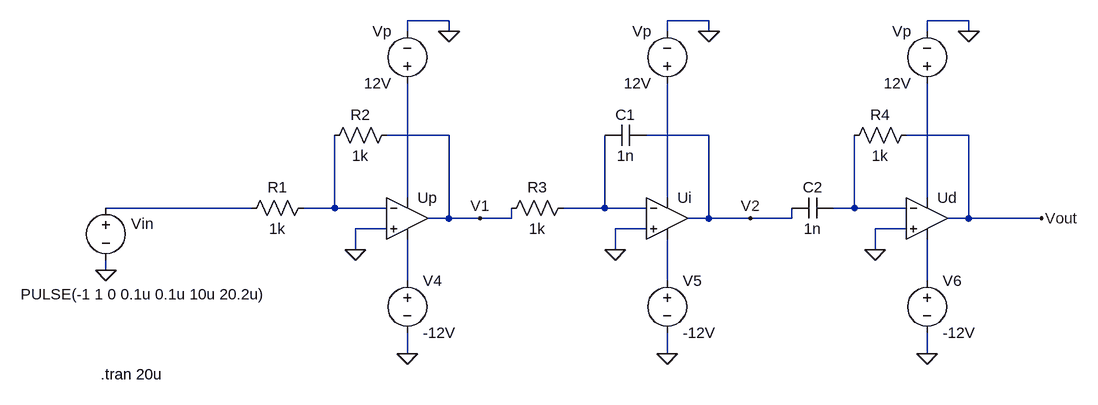
[diagram p0: schematic Draft1.asc]
Draft1.asc, the LTspice schematic file:
Version 4
SHEET 1 984 680
WIRE 0 -144 -64 -144
WIRE 400 -144 336 -144
WIRE 800 -144 736 -144
WIRE -64 -128 -64 -144
WIRE 0 -128 0 -144
WIRE 336 -128 336 -144
WIRE 400 -128 400 -144
WIRE 736 -128 736 -144
WIRE 800 -128 800 -144
WIRE 0 32 -96 32
WIRE 400 32 304 32
WIRE 800 32 704 32
WIRE -64 128 -64 -48
WIRE 336 128 336 -48
WIRE 736 128 736 -48
WIRE -304 144 -528 144
WIRE -176 144 -176 32
WIRE -176 144 -224 144
WIRE -96 144 -176 144
WIRE 240 144 240 32
WIRE 240 144 176 144
WIRE 304 144 240 144
WIRE 624 144 624 32
WIRE 624 144 592 144
WIRE 704 144 624 144
WIRE 0 160 0 32
WIRE 0 160 -32 160
WIRE 48 160 0 160
WIRE 96 160 96 144
WIRE 96 160 48 160
WIRE 400 160 400 32
WIRE 400 160 368 160
WIRE 464 160 400 160
WIRE 528 160 528 144
WIRE 528 160 464 160
WIRE 800 160 800 32
WIRE 800 160 768 160
WIRE 912 160 800 160
WIRE -96 176 -144 176
WIRE 304 176 256 176
WIRE 704 176 656 176
WIRE -144 208 -144 176
WIRE 256 208 256 176
WIRE 656 208 656 176
WIRE -528 240 -528 224
WIRE -64 256 -64 192
WIRE 336 256 336 192
WIRE 736 256 736 192
WIRE -64 368 -64 336
WIRE 336 368 336 336
WIRE 736 368 736 336
FLAG -144 208 0
FLAG 256 208 0
FLAG 656 208 0
FLAG 912 160 Vout
FLAG 0 -128 0
FLAG 400 -128 0
FLAG 800 -128 0
FLAG -64 368 0
FLAG 336 368 0
FLAG 736 368 0
FLAG 48 160 V1
FLAG 464 160 V2
FLAG -528 240 0
SYMBOL Opamps\\UniversalOpamp2 -64 160 R0
SYMATTR InstName Up
SYMBOL Opamps\\UniversalOpamp2 336 160 R0
SYMATTR InstName Ui
SYMBOL Opamps\\UniversalOpamp2 736 160 R0
SYMATTR InstName Ud
SYMBOL res -208 128 R90
WINDOW 0 0 56 VBottom 2
WINDOW 3 32 56 VTop 2
SYMATTR InstName R1
SYMATTR Value 1k
SYMBOL res -80 16 R90
WINDOW 0 0 56 VBottom 2
WINDOW 3 32 56 VTop 2
SYMATTR InstName R2
SYMATTR Value 1k
SYMBOL res 192 128 R90
WINDOW 0 0 56 VBottom 2
WINDOW 3 32 56 VTop 2
SYMATTR InstName R3
SYMATTR Value 1k
SYMBOL res 720 16 R90
WINDOW 0 0 56 VBottom 2
WINDOW 3 32 56 VTop 2
SYMATTR InstName R4
SYMATTR Value 1k
SYMBOL cap 304 16 R90
WINDOW 0 0 32 VBottom 2
WINDOW 3 32 32 VTop 2
SYMATTR InstName C1
SYMATTR Value 1n
SYMBOL cap 592 128 R90
WINDOW 0 0 32 VBottom 2
WINDOW 3 32 32 VTop 2
SYMATTR InstName C2
SYMATTR Value 1n
SYMBOL voltage -64 240 R0
WINDOW 123 0 0 Left 0
WINDOW 39 0 0 Left 0
SYMATTR InstName V4
SYMATTR Value -12V
SYMBOL voltage 336 240 R0
WINDOW 123 0 0 Left 0
WINDOW 39 0 0 Left 0
SYMATTR InstName V5
SYMATTR Value -12V
SYMBOL voltage 736 240 R0
WINDOW 123 0 0 Left 0
WINDOW 39 0 0 Left 0
SYMATTR InstName V6
SYMATTR Value -12V
SYMBOL voltage -64 -32 R180
WINDOW 0 24 96 Left 2
WINDOW 3 24 16 Left 2
WINDOW 123 0 0 Left 0
WINDOW 39 0 0 Left 0
SYMATTR InstName Vp
SYMATTR Value 12V
SYMBOL voltage 336 -32 R180
WINDOW 0 24 96 Left 2
WINDOW 3 24 16 Left 2
WINDOW 123 0 0 Left 0
WINDOW 39 0 0 Left 0
SYMATTR InstName Vp
SYMATTR Value 12V
SYMBOL voltage 736 -32 R180
WINDOW 0 24 96 Left 2
WINDOW 3 24 16 Left 2
WINDOW 123 0 0 Left 0
WINDOW 39 0 0 Left 0
SYMATTR InstName Vp
SYMATTR Value 12V
SYMBOL voltage -528 128 R0
WINDOW 0 39 40 Left 2
WINDOW 3 -131 149 Left 2
WINDOW 123 0 0 Left 0
WINDOW 39 0 0 Left 0
SYMATTR InstName Vin
SYMATTR Value PULSE(-1 1 0 0.1u 0.1u 10u 20.2u)
TEXT -536 400 Left 2 !.tran 20u

The netlist it stands for:
* Draft1.asc
XUp 0 N005 N001 N008 V1 level.2 Avol=1Meg GBW=10Meg Slew=10Meg ilimit=25m rail=0 Vos=0 phimargin=45 en=0 enk=0 in=0 ink=0 Rin=500Meg  ; pins IN+ IN- V+ V- OUT
XUi 0 N006 N002 N009 V2 level.2 Avol=1Meg GBW=10Meg Slew=10Meg ilimit=25m rail=0 Vos=0 phimargin=45 en=0 enk=0 in=0 ink=0 Rin=500Meg  ; pins IN+ IN- V+ V- OUT
XUd 0 N007 N003 N010 Vout level.2 Avol=1Meg GBW=10Meg Slew=10Meg ilimit=25m rail=0 Vos=0 phimargin=45 en=0 enk=0 in=0 ink=0 Rin=500Meg  ; pins IN+ IN- V+ V- OUT
R1 N005 N004 1k
R2 V1 N005 1k
R3 N006 V1 1k
R4 Vout N007 1k
C1 V2 N006 1n
C2 N007 V2 1n
V4 N008 0 -12V
V5 N009 0 -12V
V6 N010 0 -12V
Vp N001 0 12V
Vp N002 0 12V
Vp N003 0 12V
Vin N004 0 PULSE(-1 1 0 0.1u 0.1u 10u 20.2u)
.tran 20u
.lib UniversalOpamps2.sub
.backanno
.end